# Altium schematic sheet RGMII ETH PHY.SchDoc: RK3399 COB Design V1.0
size A4; Author: AVIRAL MISHRA; DocumentNumber: 17; SheetNumber: 17; SheetTotal: 27; PROJECT CODE: A_V1.0
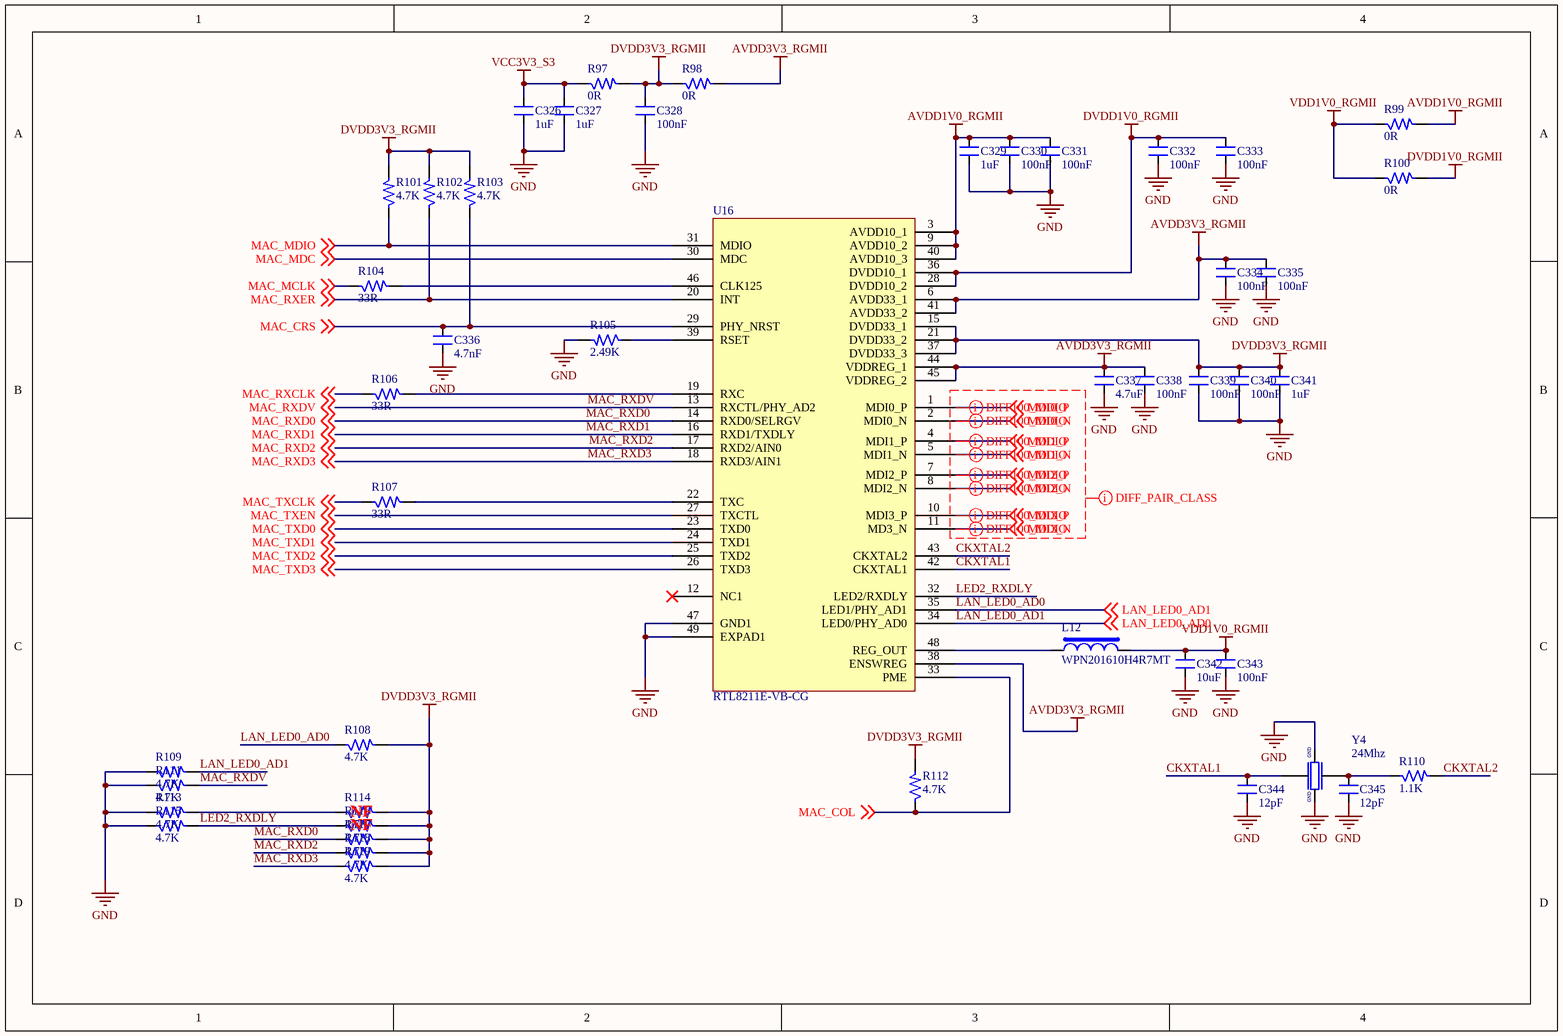
[diagram p0: RGMII ETH PHY.SchDoc]

## Parts
C326  1uF  [CAP_0603]
C327  1uF  [CAP_0603]
C328  100nF  [CAP_0603]
C329  1uF  [CAP_0603]
C330  100nF  [CAP_0603]
C331  100nF  [CAP_0603]
C332  100nF  [CAP_0603]
C333  100nF  [CAP_0603]
C334  100nF  [CAP_0603]
C335  100nF  [CAP_0603]
C336  4.7nF  [CAP_0603]
C337  4.7uF  [CAP_0603]
C338  100nF  [CAP_0603]
C339  100nF  [CAP_0603]
C340  100nF  [CAP_0603]
C341  1uF  [CAP_0603]
C342  10uF  [CAP_0603]
C343  100nF  [CAP_0603]
C344  12pF  [CAP_0603]
C345  12pF  [CAP_0603]
L12  WPN201610H4R7MT  [IND_62.9_110X86.6_SMD]
R97  0R  [RES_0603]
R98  0R  [RES_0603]
R99  0R  [RES_0603]
R100  0R  [RES_0603]
R101  4.7K  [RES_0603]
R102  4.7K  [RES_0603]
R103  4.7K  [RES_0603]
R104  33R  [RES_0402]
R105  2.49K  [RES_0603]
R106  33R  [RES_0402]
R107  33R  [RES_0402]
R108  4.7K  [RES_0603]
R109  4.7K  [RES_0603]
R110  1.1K  [RES_0603]
R111  4.7K  [RES_0603]
R112  4.7K  [RES_0603]
R113  4.7K  [RES_0603]
R114  4.7K  [RES_0603]
R115  4.7K  [RES_0603]
R116  4.7K  [RES_0603]
R117  4.7K  [RES_0603]
R118  4.7K  [RES_0603]
R119  4.7K  [RES_0603]
U16  RTL8211E-VB-CG  [QFN48_19.6_324X324_SMD]
Y4  24Mhz  [XTAL_ABM8AIG-24.000MHZ-12-2Z-T3]

## Nets
AVDD1V0_RGMII: C329.2 C330.2 C331.2 R99.2 U16.3(AVDD10_1) U16.9(AVDD10_2) U16.40(AVDD10_3)
AVDD3V3_RGMII: C334.2 C335.2 C337.2 C338.2 R98.2 U16.6(AVDD33_1) U16.38(ENSWREG) U16.41(AVDD33_2) U16.44(VDDREG_1) U16.45(VDDREG_2)
DVDD1V0_RGMII: C332.2 C333.2 R100.2 U16.28(DVDD10_2) U16.36(DVDD10_1)
DVDD3V3_RGMII: C328.2 C339.2 C340.2 C341.2 R97.2 R98.1 R101.2 R102.2 R103.2 R108.2 R112.2 R114.2 R116.2 R117.2 R118.2 R119.2 U16.15(DVDD33_1) U16.21(DVDD33_2) U16.37(DVDD33_3)
GND: C326.1 C327.1 C328.1 C329.1 C330.1 C331.1 C332.1 C333.1 C334.1 C335.1 C336.1 C337.1 C338.1 C339.1 C340.1 C341.1 C342.1 C343.1 C344.1 C345.1 R105.2 R109.1 R111.1 R113.1 R115.1 U16.47(GND1) U16.49(EXPAD1) Y4.2 Y4.4
VCC3V3_S3: C326.2 C327.2 R97.1
VDD1V0_RGMII: C342.2 C343.2 L12.2 R99.1 R100.1
CKXTAL1: C344.2 U16.42(CKXTAL1) Y4.1
CKXTAL2: R110.2 U16.43(CKXTAL2)
LAN_LED0_AD0: R108.1 R109.2 U16.34(LED0/PHY_AD0) U16.35(LED1/PHY_AD1) ; off-sheet LAN_LED0_AD0, off-sheet LAN_LED0_AD1  [also labelled LAN_LED0_AD1]
LED2_RXDLY: R115.2 R116.1 U16.32(LED2/RXDLY)
MAC_COL: R112.1 U16.33(PME) ; off-sheet MAC_COL
MAC_CRS: C336.2 R103.1 U16.29(PHY_NRST) ; off-sheet MAC_CRS
MAC_MCLK: R104.1 ; off-sheet MAC_MCLK
MAC_MDC: U16.30(MDC) ; off-sheet MAC_MDC
MAC_MDIO: R101.1 U16.31(MDIO) ; off-sheet MAC_MDIO
MAC_RXCLK: R106.1 ; off-sheet MAC_RXCLK
MAC_RXD0: R117.1 U16.14(RXD0/SELRGV) ; off-sheet MAC_RXD0
MAC_RXD1: U16.16(RXD1/TXDLY) ; off-sheet MAC_RXD1
MAC_RXD2: R118.1 U16.17(RXD2/AIN0) ; off-sheet MAC_RXD2
MAC_RXD3: R119.1 U16.18(RXD3/AIN1) ; off-sheet MAC_RXD3
MAC_RXDV: R111.2 U16.13(RXCTL/PHY_AD2) ; off-sheet MAC_RXDV
MAC_RXER: R102.1 U16.20(INT) ; off-sheet MAC_RXER
MAC_TXCLK: R107.1 ; off-sheet MAC_TXCLK
MAC_TXD0: U16.23(TXD0) ; off-sheet MAC_TXD0
MAC_TXD1: U16.24(TXD1) ; off-sheet MAC_TXD1
MAC_TXD2: U16.25(TXD2) ; off-sheet MAC_TXD2
MAC_TXD3: U16.26(TXD3) ; off-sheet MAC_TXD3
MAC_TXEN: U16.27(TXCTL) ; off-sheet MAC_TXEN
MDI0_N: U16.2(MDI0_N) ; off-sheet MDI0_N
MDI0_P: U16.1(MDI0_P) ; off-sheet MDI0_P
MDI1_N: U16.5(MDI1_N) ; off-sheet MDI1_N
MDI1_P: U16.4(MDI1_P) ; off-sheet MDI1_P
MDI2_N: U16.8(MDI2_N) ; off-sheet MDI2_N
MDI2_P: U16.7(MDI2_P) ; off-sheet MDI2_P
MDI3_N: U16.11(MD3_N) ; off-sheet MDI3_N
MDI3_P: U16.10(MDI3_P) ; off-sheet MDI3_P
NetC345_2: C345.2 R110.1 Y4.3
NetL12_1: L12.1 U16.48(REG_OUT)
NetR104_2: R104.2 U16.46(CLK125)
NetR105_1: R105.1 U16.39(RSET)
NetR106_2: R106.2 U16.19(RXC)
NetR107_2: R107.2 U16.22(TXC)
NetR113_2: R113.2 R114.1

Not connected (* = marked no-connect by the designer): U16 12(NC1)*

## Layout directives
differential pair; differential pair class DIFF100_MDIO: MDI0_N, MDI0_P, MDI1_N, MDI1_P, MDI2_N, MDI2_P, MDI3_N, MDI3_P
net class DIFF_PAIR_CLASS: MDI0_N, MDI0_P, MDI1_N, MDI1_P, MDI2_N, MDI2_P, MDI3_N, MDI3_P

## Notes on the sheet
- NF
- TITLE:
- DOCUMENT NAME:
- SCALE 1:1
- This document is copyright of EsteemPCB and shall not be revealed, produced, copied, in whole or in part, nor
- PROJECT CODE:
- TEMPLATE:
- A4
- AUTHOR:
- Sheet
- of
- used for any purpose other than submitted.
- (in symbol XTAL_24Mhz-12pF-4-SMD) GND

## Library data of the parts
C326 C327 C329 C341 = CAP_1uF-10V-5%-0603: 1µF ±10% 10V Ceramic Capacitor X5R 0603 (1608 Metric) /; Manufacturer: Samsung Electro-Mechanics; Manufacturer Part Number: CL10A105KP8NNNC; Case/Package: 0603; Supplier-1: Digikey
C328 C330-C335 C338-C340 C343 = CAP_100nF-10V-5%-0603: 0.1µF ±10% 10V Ceramic Capacitor X7R 0603 (1608 Metric) /; Manufacturer: Yageo; Manufacturer Part Number: CC0603KRX7R6BB104; Case/Package: 0603; Supplier-1: Digikey
C336 = CAP_4.7nF-10V-10%-0603: 4700pF ±10% 10V Ceramic Capacitor X7R 0603 (1608 Metric) /; Manufacturer: KEMET; Manufacturer Part Number: C0603C472K8RACTU; Case/Package: 0603; Supplier-1: Digikey
C337 = CAP_4.7uF-16V-10%-0603: 4.7µF ±10% 16V Ceramic Capacitor X5R 0603 (1608 Metric) /; Manufacturer: Murata Electronics; Manufacturer Part Number: GRM188R61C475KAAJD; Case/Package: 0603; Supplier-1: Digikey
C342 = CAP_10uF-10V-10%-0603: 10µF ±10% 10V Ceramic Capacitor X5R 0603 (1608 Metric) /; Manufacturer Part Number: GRM188R61A106KE69J; Manufacturer: Murata Electronics; Case/Package: 0603; Supplier-1: Digikey
C344 C345 = CAP_12pF-10V-10%-0603: 12pF ±10% 10V Ceramic Capacitor X8R 0603 (1608 Metric) /; Manufacturer: KEMET; Manufacturer Part Number: C0603X120K8HAC7867; Case/Package: 0603; Supplier-1: Digikey
L12 = IND_4.7uH-0.9A-20%-SMD: 4.7uH ±20% 900mA 425mΩ SMD,2.0x1.6x1.0mm Power Inductors RoHS /; Manufacturer: Sunlord; Manufacturer Part Number: WPN201610H4R7MT; Case/Package: SMD; Supplier-1: LCSC
R97-R100 = RES_0R-0.1W-1%-0603: 0 Ohms Jumper 0.1W, 1/10W Chip Resistor 0603 (1608 Metric) Thick Film; Manufacturer: Yageo; Manufacturer Part Number: RC0603JR-070RL; Case/Package: 0603; Supplier-1: Digikey
R101-R103 R108 R109 R111-R119 = RES_4.7K-0.1W-1%-0603: 4.7 kOhms ±1% 0.1W, 1/10W Chip Resistor 0603 (1608 Metric) Automotive AEC-Q200, Moisture Resistant Thick Film /; Manufacturer: TE Connectivity Passive Product; Manufacturer Part Number: CRGCQ0603F4K7; Case/Package: 0603; Supplier-1: Digikey
R104 R106 R107 = RES_33R-0.1W-1%-0402: 33 Ohms ±1% 0.1W, 1/10W Chip Resistor 0402 (1005 Metric) Automotive AEC-Q200 Thick Film /; Manufacturer: Panasonic Electronic Components; Manufacturer Part Number: ERJ-2RKF33R0X; Case/Package: 0402; Supplier-1: Digikey
R105 = RES_2.49K-0.1W-1%-0603: 2.49 kOhms ±1% 0.1W, 1/10W Chip Resistor 0603 (1608 Metric) Automotive AEC-Q200 Thick Film /; Manufacturer: Stackpole Electronics Inc; Manufacturer Part Number: RMCF0603FT2K49; Case/Package: 0603; Supplier-1: Digikey
R110 = RES_1.1K-0.1W-1%-0603: 47 kOhms ±1% 0.1W, 1/10W Chip Resistor 0603 (1608 Metric) Thick Film /; Manufacturer: Yageo; Manufacturer Part Number: RC0603FR-0747KL; Case/Package: 0603; Supplier-1: Digikey
U16 = IC_RTL8211E-VB-CG: Ethernet Transceivers 10/100/1000 Base-T PHY GMII, MII, RGMII 1.43V ~ 3.63V QFN-48_6x6x04P Ethernet ICs RoHS; Manufacturer: Realtek Semicon; Manufacturer Part Number: RTL8211E-VB-CG; Case/Package: QFN-48; Supplier-1: LCSC
Y4 = XTAL_24Mhz-12pF-4-SMD: 24MHz ±20ppm Crystal 12pF 50 Ohms 4-SMD, No Lead /; Manufacturer: Abracon LLC; Manufacturer Part Number: ABM8AIG-24.000MHZ-12-2Z-T3; Case/Package: SMD; Supplier-1: Digikey